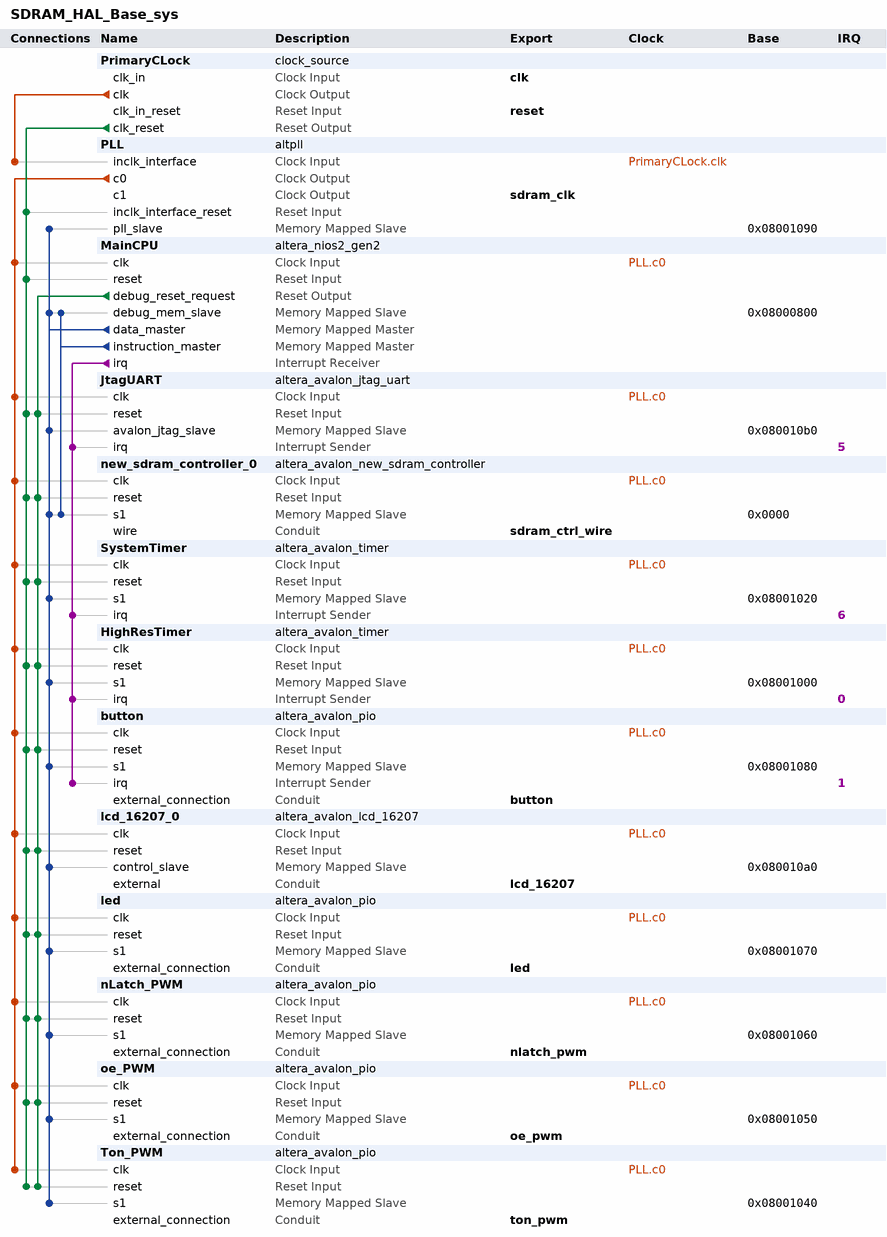
[diagram p0: system contents]
# Platform Designer (Qsys) system SDRAM_HAL_Base_sys, Cyclone IV E EP4CE115F29C7
# Parameters at their usual value, and those the tool derives, are not listed.
package require -exact qsys 17.1
create_system SDRAM_HAL_Base_sys
set_project_property DEVICE_FAMILY {Cyclone IV E}
set_project_property DEVICE EP4CE115F29C7

add_instance PrimaryCLock clock_source 17.1
set_instance_parameter_value PrimaryCLock clockFrequency 50000000

add_instance PLL altpll 17.1
set_instance_parameter_value PLL CLK0_DIVIDE_BY 1
set_instance_parameter_value PLL CLK0_MULTIPLY_BY 2
set_instance_parameter_value PLL CLK1_DIVIDE_BY 1
set_instance_parameter_value PLL CLK1_DUTY_CYCLE 50
set_instance_parameter_value PLL CLK1_MULTIPLY_BY 2
set_instance_parameter_value PLL CLK1_PHASE_SHIFT -1667
set_instance_parameter_value PLL INCLK0_INPUT_FREQUENCY 20000
set_instance_parameter_value PLL PORT_ARESET PORT_UNUSED
set_instance_parameter_value PLL PORT_LOCKED PORT_UNUSED
set_instance_parameter_value PLL PORT_clk1 PORT_USED
set_instance_parameter_value PLL PORT_clk2 PORT_UNUSED
set_instance_parameter_value PLL PORT_clk3 PORT_UNUSED

add_instance MainCPU altera_nios2_gen2 17.1
set_instance_parameter_value MainCPU dcache_size 2048
set_instance_parameter_value MainCPU exceptionSlave new_sdram_controller_0.s1
set_instance_parameter_value MainCPU icache_size 4096
set_instance_parameter_value MainCPU impl Tiny
set_instance_parameter_value MainCPU resetSlave new_sdram_controller_0.s1

add_instance JtagUART altera_avalon_jtag_uart 17.1
set_instance_parameter_value JtagUART simInteractiveOptions NO_INTERACTIVE_WINDOWS

add_instance new_sdram_controller_0 altera_avalon_new_sdram_controller 17.1
set_instance_parameter_value new_sdram_controller_0 TAC 5.5
set_instance_parameter_value new_sdram_controller_0 TRCD 20.0
set_instance_parameter_value new_sdram_controller_0 TRP 20.0
set_instance_parameter_value new_sdram_controller_0 casLatency 3
set_instance_parameter_value new_sdram_controller_0 columnWidth 10
set_instance_parameter_value new_sdram_controller_0 dataWidth 32
set_instance_parameter_value new_sdram_controller_0 generateSimulationModel false
set_instance_parameter_value new_sdram_controller_0 model single_Micron_MT48LC4M32B2_7_chip
set_instance_parameter_value new_sdram_controller_0 numberOfBanks 4
set_instance_parameter_value new_sdram_controller_0 numberOfChipSelects 1
set_instance_parameter_value new_sdram_controller_0 powerUpDelay 200.0
set_instance_parameter_value new_sdram_controller_0 refreshPeriod 7.8125
set_instance_parameter_value new_sdram_controller_0 rowWidth 13

add_instance SystemTimer altera_avalon_timer 17.1
set_instance_parameter_value SystemTimer period 1
set_instance_parameter_value SystemTimer periodUnits MSEC

add_instance HighResTimer altera_avalon_timer 17.1
set_instance_parameter_value HighResTimer period 1
set_instance_parameter_value HighResTimer periodUnits USEC

add_instance button altera_avalon_pio 17.1
set_instance_parameter_value button direction Input
set_instance_parameter_value button generateIRQ true
set_instance_parameter_value button width 4

add_instance lcd_16207_0 altera_avalon_lcd_16207 17.1

add_instance led altera_avalon_pio 17.1
set_instance_parameter_value led direction Output
set_instance_parameter_value led width 24

add_instance nLatch_PWM altera_avalon_pio 17.1
set_instance_parameter_value nLatch_PWM direction Output
set_instance_parameter_value nLatch_PWM width 24

add_instance oe_PWM altera_avalon_pio 17.1
set_instance_parameter_value oe_PWM direction Output
set_instance_parameter_value oe_PWM width 24

add_instance Ton_PWM altera_avalon_pio 17.1
set_instance_parameter_value Ton_PWM direction Output
set_instance_parameter_value Ton_PWM width 10

# connections
add_connection PLL.c0 button.clk clock
add_connection PLL.c0 HighResTimer.clk clock
add_connection PLL.c0 JtagUART.clk clock
add_connection PLL.c0 lcd_16207_0.clk clock
add_connection PLL.c0 led.clk clock
add_connection PLL.c0 MainCPU.clk clock
add_connection PLL.c0 new_sdram_controller_0.clk clock
add_connection PLL.c0 nLatch_PWM.clk clock
add_connection PLL.c0 oe_PWM.clk clock
add_connection PLL.c0 SystemTimer.clk clock
add_connection PLL.c0 Ton_PWM.clk clock
add_connection PrimaryCLock.clk PLL.inclk_interface clock
add_connection MainCPU.debug_reset_request button.reset reset
add_connection MainCPU.debug_reset_request HighResTimer.reset reset
add_connection MainCPU.debug_reset_request JtagUART.reset reset
add_connection MainCPU.debug_reset_request lcd_16207_0.reset reset
add_connection MainCPU.debug_reset_request led.reset reset
add_connection MainCPU.debug_reset_request new_sdram_controller_0.reset reset
add_connection MainCPU.debug_reset_request nLatch_PWM.reset reset
add_connection MainCPU.debug_reset_request oe_PWM.reset reset
add_connection MainCPU.debug_reset_request SystemTimer.reset reset
add_connection MainCPU.debug_reset_request Ton_PWM.reset reset
add_connection PrimaryCLock.clk_reset button.reset reset
add_connection PrimaryCLock.clk_reset HighResTimer.reset reset
add_connection PrimaryCLock.clk_reset JtagUART.reset reset
add_connection PrimaryCLock.clk_reset lcd_16207_0.reset reset
add_connection PrimaryCLock.clk_reset led.reset reset
add_connection PrimaryCLock.clk_reset MainCPU.reset reset
add_connection PrimaryCLock.clk_reset new_sdram_controller_0.reset reset
add_connection PrimaryCLock.clk_reset nLatch_PWM.reset reset
add_connection PrimaryCLock.clk_reset oe_PWM.reset reset
add_connection PrimaryCLock.clk_reset PLL.inclk_interface_reset reset
add_connection PrimaryCLock.clk_reset SystemTimer.reset reset
add_connection PrimaryCLock.clk_reset Ton_PWM.reset reset
add_connection MainCPU.data_master button.s1 avalon
set_connection_parameter_value MainCPU.data_master/button.s1 baseAddress 0x08001080
add_connection MainCPU.data_master HighResTimer.s1 avalon
set_connection_parameter_value MainCPU.data_master/HighResTimer.s1 baseAddress 0x08001000
add_connection MainCPU.data_master JtagUART.avalon_jtag_slave avalon
set_connection_parameter_value MainCPU.data_master/JtagUART.avalon_jtag_slave baseAddress 0x080010b0
add_connection MainCPU.data_master lcd_16207_0.control_slave avalon
set_connection_parameter_value MainCPU.data_master/lcd_16207_0.control_slave baseAddress 0x080010a0
add_connection MainCPU.data_master led.s1 avalon
set_connection_parameter_value MainCPU.data_master/led.s1 baseAddress 0x08001070
add_connection MainCPU.data_master MainCPU.debug_mem_slave avalon
set_connection_parameter_value MainCPU.data_master/MainCPU.debug_mem_slave baseAddress 0x08000800
add_connection MainCPU.data_master new_sdram_controller_0.s1 avalon
set_connection_parameter_value MainCPU.data_master/new_sdram_controller_0.s1 baseAddress 0x0000
add_connection MainCPU.data_master nLatch_PWM.s1 avalon
set_connection_parameter_value MainCPU.data_master/nLatch_PWM.s1 baseAddress 0x08001060
add_connection MainCPU.data_master oe_PWM.s1 avalon
set_connection_parameter_value MainCPU.data_master/oe_PWM.s1 baseAddress 0x08001050
add_connection MainCPU.data_master PLL.pll_slave avalon
set_connection_parameter_value MainCPU.data_master/PLL.pll_slave baseAddress 0x08001090
add_connection MainCPU.data_master SystemTimer.s1 avalon
set_connection_parameter_value MainCPU.data_master/SystemTimer.s1 baseAddress 0x08001020
add_connection MainCPU.data_master Ton_PWM.s1 avalon
set_connection_parameter_value MainCPU.data_master/Ton_PWM.s1 baseAddress 0x08001040
add_connection MainCPU.instruction_master MainCPU.debug_mem_slave avalon
set_connection_parameter_value MainCPU.instruction_master/MainCPU.debug_mem_slave baseAddress 0x08000800
add_connection MainCPU.instruction_master new_sdram_controller_0.s1 avalon
set_connection_parameter_value MainCPU.instruction_master/new_sdram_controller_0.s1 baseAddress 0x0000
add_connection MainCPU.irq button.irq interrupt
set_connection_parameter_value MainCPU.irq/button.irq irqNumber 1
add_connection MainCPU.irq HighResTimer.irq interrupt
set_connection_parameter_value MainCPU.irq/HighResTimer.irq irqNumber 0
add_connection MainCPU.irq JtagUART.irq interrupt
set_connection_parameter_value MainCPU.irq/JtagUART.irq irqNumber 5
add_connection MainCPU.irq SystemTimer.irq interrupt
set_connection_parameter_value MainCPU.irq/SystemTimer.irq irqNumber 6

# exported interfaces
add_interface button conduit end
set_interface_property button EXPORT_OF button.external_connection
add_interface clk clock sink
set_interface_property clk EXPORT_OF PrimaryCLock.clk_in
add_interface lcd_16207 conduit end
set_interface_property lcd_16207 EXPORT_OF lcd_16207_0.external
add_interface led conduit end
set_interface_property led EXPORT_OF led.external_connection
add_interface nlatch_pwm conduit end
set_interface_property nlatch_pwm EXPORT_OF nLatch_PWM.external_connection
add_interface oe_pwm conduit end
set_interface_property oe_pwm EXPORT_OF oe_PWM.external_connection
add_interface reset reset sink
set_interface_property reset EXPORT_OF PrimaryCLock.clk_in_reset
add_interface sdram_clk clock source
set_interface_property sdram_clk EXPORT_OF PLL.c1
add_interface sdram_ctrl_wire conduit end
set_interface_property sdram_ctrl_wire EXPORT_OF new_sdram_controller_0.wire
add_interface ton_pwm conduit end
set_interface_property ton_pwm EXPORT_OF Ton_PWM.external_connection

set_interconnect_requirement {$system} qsys_mm.clockCrossingAdapter HANDSHAKE
set_interconnect_requirement {$system} qsys_mm.enableEccProtection FALSE
set_interconnect_requirement {$system} qsys_mm.insertDefaultSlave FALSE
set_interconnect_requirement {$system} qsys_mm.maxAdditionalLatency 1

save_system SDRAM_HAL_Base_sys.qsys
